# Altium project SPEC_A7.PrjPcb (part 1 of 7)
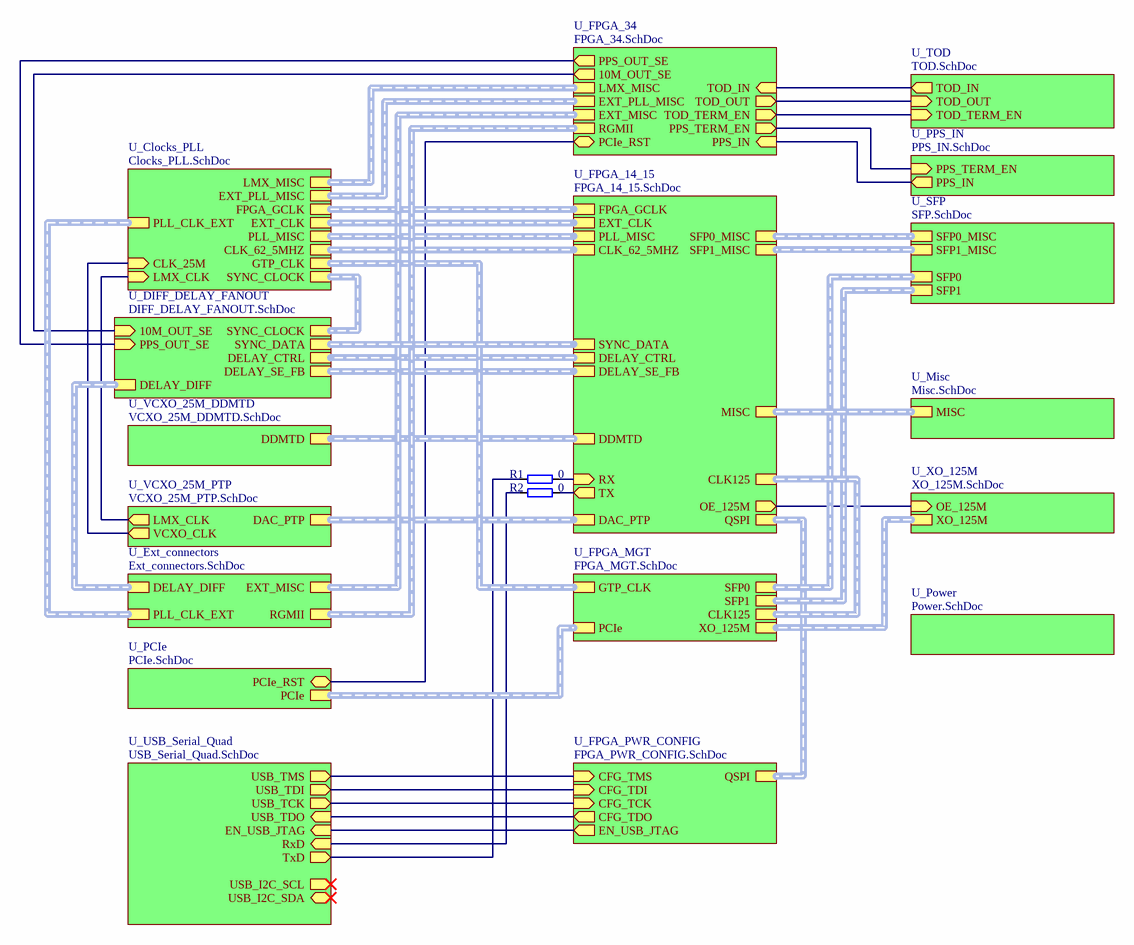
[diagram p0: SPEC-A7-TOP.SchDoc]
P_version: 1.1
18 sheets, 746 parts. Net scope: hierarchical (ports join the sheet entries above them; power ports are global).
Board file: SPEC-A7.PcbDoc
Sheets:
  SPEC-A7-TOP.SchDoc
    U_Clocks_PLL = Clocks_PLL.SchDoc
    U_FPGA_14_15 = FPGA_14_15.SchDoc
    U_DIFF_DELAY_FANOUT = DIFF_DELAY_FANOUT.SchDoc
    U_VCXO_25M_DDMTD = VCXO_25M_DDMTD.SchDoc
    U_VCXO_25M_PTP = VCXO_25M_PTP.SchDoc
    U_SFP = SFP.SchDoc
    U_FPGA_34 = FPGA_34.SchDoc
    U_USB_Serial_Quad = USB_Serial_Quad.SchDoc
    U_XO_125M = XO_125M.SchDoc
    U_FPGA_PWR_CONFIG = FPGA_PWR_CONFIG.SchDoc
    U_Ext_connectors = Ext_connectors.SchDoc
    U_FPGA_MGT = FPGA_MGT.SchDoc
    U_PCIe = PCIe.SchDoc
    U_Power = Power.SchDoc
    U_Misc = Misc.SchDoc
    U_TOD = TOD.SchDoc
    U_PPS_IN = PPS_IN.SchDoc

## Sheet SPEC-A7-TOP.SchDoc: SPEC-A7
size 420 x 297 mm; Author: G.Kasprowicz; CompanyName: WUT ISE; DrawnBy: G.Kasprowicz; Organization: WUT ISE; Address1: PW ISE; Address2: Nowowiejska 15/19 00-665 Warsaw; Address3: gkasprow@gmail.com; Revision: 2; SheetNumber: 1; SheetTotal: 18; ModifiedBy: -; CheckedDate: -; Title2: TOP; DivGrp: WUT ISE; Designer: G.Kasprowicz; ModifiedDate: -; ProjectName: Sensor Box

### Parts
R1  0  [RESC1005X40N]
R2  0  [RESC1005X40N]

### Sub-sheets
U_Clocks_PLL = Clocks_PLL.SchDoc: CLK_25M (in), PLL_MISC (harness PLL_MISC), LMX_CLK (in), LMX_MISC (harness LMX_MISC), EXT_PLL_MISC (harness PLL_MISC), CLK_62_5MHZ (harness CLK), EXT_CLK (harness CLK), PLL_CLK_EXT (harness PLL_CLK), FPGA_GCLK (harness CLK), SYNC_CLOCK (harness DFF), GTP_CLK (harness CLK)
U_DIFF_DELAY_FANOUT = DIFF_DELAY_FANOUT.SchDoc: SYNC_DATA (harness DFF), DELAY_DIFF (harness DELAY_DIFF), DELAY_CTRL (harness DELAY_CTRL), DELAY_SE_FB (harness DELAY_SE_FB), 10M_OUT_SE (in), PPS_OUT_SE (in), SYNC_CLOCK
U_Ext_connectors = Ext_connectors.SchDoc: RGMII (harness RGMII), EXT_MISC (harness EXT_CON_MISC), PLL_CLK_EXT (harness PLL_CLK), DELAY_DIFF (harness DELAY_DIFF)
U_FPGA_14_15 = FPGA_14_15.SchDoc: DDMTD (harness DDMTD), DAC_PTP (harness DAC_PTP), PLL_MISC (harness PLL_MISC), DELAY_CTRL (harness DELAY_CTRL), SYNC_DATA (harness SYNC_DATA), DELAY_SE_FB (harness DELAY_SE_FB), SFP0_MISC (harness SFP_MISC), SFP1_MISC (harness SFP_MISC), MISC (harness MISC), QSPI (harness QSPI), OE_125M (out), RX (in), TX (out), CLK_62_5MHZ (harness CLK), EXT_CLK (harness CLK), FPGA_GCLK (harness CLK), CLK125 (harness CLK)
U_FPGA_34 = FPGA_34.SchDoc: EXT_PLL_MISC (harness PLL_MISC), LMX_MISC (harness LMX_MISC), PCIe_RST (bidir), EXT_MISC (harness EXT_CON_MISC), RGMII (harness RGMII), TOD_IN (in), TOD_OUT (out), TOD_TERM_EN (out), PPS_TERM_EN (out), PPS_IN (in), PPS_OUT_SE (out), 10M_OUT_SE (out)
U_FPGA_MGT = FPGA_MGT.SchDoc: XO_125M (harness XO_125M), SFP0 (harness SFP), SFP1 (harness SFP), PCIe (harness PCIe), GTP_CLK (harness CLK), CLK125 (harness CLK)
U_FPGA_PWR_CONFIG = FPGA_PWR_CONFIG.SchDoc: CFG_TMS (in), CFG_TCK (in), CFG_TDO (out), CFG_TDI (in), EN_USB_JTAG (out), QSPI (harness QSPI)
U_Misc = Misc.SchDoc: MISC (harness MISC)
U_PCIe = PCIe.SchDoc: PCIe_RST (bidir), PCIe (harness PCIe)
U_Power = Power.SchDoc: no entries
U_PPS_IN = PPS_IN.SchDoc: PPS_TERM_EN (in), PPS_IN (out)
U_SFP = SFP.SchDoc: SFP0_MISC (harness SFP_MISC), SFP1_MISC (harness SFP_MISC), SFP0 (harness SFP), SFP1 (harness SFP)
U_TOD = TOD.SchDoc: TOD_TERM_EN (in), TOD_IN (out), TOD_OUT (in)
U_USB_Serial_Quad = USB_Serial_Quad.SchDoc: USB_TDO (in), RxD (in), USB_TMS (out), USB_TDI (out), USB_TCK (out), TxD (out), EN_USB_JTAG (in), USB_I2C_SDA (bidir), USB_I2C_SCL (out)
U_VCXO_25M_DDMTD = VCXO_25M_DDMTD.SchDoc: DDMTD (harness DDMTD)
U_VCXO_25M_PTP = VCXO_25M_PTP.SchDoc: DAC_PTP (harness DAC_PTP), VCXO_CLK (out), LMX_CLK (out)
U_XO_125M = XO_125M.SchDoc: XO_125M (harness XO_125M), OE_125M (in)

### Nets
10M_OUT_SE: sheet U_DIFF_DELAY_FANOUT/10M_OUT_SE, sheet U_FPGA_34/10M_OUT_SE
CFG_TCK: sheet U_USB_Serial_Quad/USB_TCK, sheet U_FPGA_PWR_CONFIG/CFG_TCK
CFG_TDI: sheet U_USB_Serial_Quad/USB_TDI, sheet U_FPGA_PWR_CONFIG/CFG_TDI
CFG_TDO: sheet U_USB_Serial_Quad/USB_TDO, sheet U_FPGA_PWR_CONFIG/CFG_TDO
CFG_TMS: sheet U_USB_Serial_Quad/USB_TMS, sheet U_FPGA_PWR_CONFIG/CFG_TMS
CLK_25M: sheet U_Clocks_PLL/CLK_25M, sheet U_VCXO_25M_PTP/VCXO_CLK
OE_125M: sheet U_FPGA_14_15/OE_125M, sheet U_XO_125M/OE_125M
PCIe_RST: sheet U_FPGA_34/PCIe_RST, sheet U_PCIe/PCIe_RST
PPS_IN: sheet U_FPGA_34/PPS_IN, sheet U_PPS_IN/PPS_IN
PPS_OUT_SE: sheet U_DIFF_DELAY_FANOUT/PPS_OUT_SE, sheet U_FPGA_34/PPS_OUT_SE
RX: R1.2 ; sheet U_FPGA_14_15/RX
RXD_USB: R2.1 ; sheet U_USB_Serial_Quad/RxD
TOD_IN: sheet U_FPGA_34/TOD_IN, sheet U_TOD/TOD_IN
TOD_OUT: sheet U_FPGA_34/TOD_OUT, sheet U_TOD/TOD_OUT
TX: R2.2 ; sheet U_FPGA_14_15/TX
TXD_USB: R1.1 ; sheet U_USB_Serial_Quad/TxD
NetC134_2: sheet U_USB_Serial_Quad/EN_USB_JTAG, sheet U_FPGA_PWR_CONFIG/EN_USB_JTAG
NetIC4_L2: sheet U_FPGA_34/PPS_TERM_EN, sheet U_PPS_IN/PPS_TERM_EN
NetIC4_T3: sheet U_FPGA_34/TOD_TERM_EN, sheet U_TOD/TOD_TERM_EN
NetIC16_8: sheet U_Clocks_PLL/LMX_CLK, sheet U_VCXO_25M_PTP/LMX_CLK

### Buses and harness runs
harness sheet U_Clocks_PLL/CLK_62_5MHZ = sheet U_FPGA_14_15/CLK_62_5MHZ
harness sheet U_Clocks_PLL/EXT_CLK = sheet U_FPGA_14_15/EXT_CLK
harness sheet U_Clocks_PLL/EXT_PLL_MISC = sheet U_FPGA_34/EXT_PLL_MISC
harness sheet U_Clocks_PLL/FPGA_GCLK = sheet U_FPGA_14_15/FPGA_GCLK
harness sheet U_Clocks_PLL/GTP_CLK = sheet U_FPGA_MGT/GTP_CLK
harness sheet U_Clocks_PLL/LMX_MISC = sheet U_FPGA_34/LMX_MISC
harness sheet U_Clocks_PLL/PLL_CLK_EXT = sheet U_Ext_connectors/PLL_CLK_EXT
harness sheet U_Clocks_PLL/PLL_MISC = sheet U_FPGA_14_15/PLL_MISC
harness sheet U_Clocks_PLL/SYNC_CLOCK = sheet U_DIFF_DELAY_FANOUT/SYNC_CLOCK
harness sheet U_DIFF_DELAY_FANOUT/DELAY_CTRL = sheet U_FPGA_14_15/DELAY_CTRL
harness sheet U_DIFF_DELAY_FANOUT/DELAY_DIFF = sheet U_Ext_connectors/DELAY_DIFF
harness sheet U_DIFF_DELAY_FANOUT/DELAY_SE_FB = sheet U_FPGA_14_15/DELAY_SE_FB
harness sheet U_DIFF_DELAY_FANOUT/SYNC_DATA = sheet U_FPGA_14_15/SYNC_DATA
harness sheet U_Ext_connectors/EXT_MISC = sheet U_FPGA_34/EXT_MISC
harness sheet U_Ext_connectors/RGMII = sheet U_FPGA_34/RGMII
harness sheet U_FPGA_14_15/CLK125 = sheet U_FPGA_MGT/CLK125
harness sheet U_FPGA_14_15/DAC_PTP = sheet U_VCXO_25M_PTP/DAC_PTP
harness sheet U_FPGA_14_15/DDMTD = sheet U_VCXO_25M_DDMTD/DDMTD
harness sheet U_FPGA_14_15/MISC = sheet U_Misc/MISC
harness sheet U_FPGA_14_15/QSPI = sheet U_FPGA_PWR_CONFIG/QSPI
harness sheet U_FPGA_14_15/SFP0_MISC = sheet U_SFP/SFP0_MISC
harness sheet U_FPGA_14_15/SFP1_MISC = sheet U_SFP/SFP1_MISC
harness sheet U_FPGA_MGT/PCIe = sheet U_PCIe/PCIe
harness sheet U_FPGA_MGT/SFP0 = sheet U_SFP/SFP0
harness sheet U_FPGA_MGT/SFP1 = sheet U_SFP/SFP1
harness sheet U_FPGA_MGT/XO_125M = sheet U_XO_125M/XO_125M

### Notes on the sheet
- Project/Equipment
- Document
- Designer
- Drawn by
- Check.by
- Copyright WUT ISE 2024.
  This documentation describes Open Hardware and is licensed under the CERN OHL v.2. You may redistribute and modify this documentation under the terms of the CERN OHL v.2. (http://ohwr.org/CERNOHL). This documentation is distributed WITHOUT ANY EXPRESS OR IMPLIED WARRANTY, INCLUDING OF MERCHANTABILITY, SATISFACTORY QUALITY AND FITNESS FOR A PARTICULAR PURPOSE. Please see the CERN OHL v.2 for applicable conditions.
- Contact
- File
- Last Mod.
- Print Date
- Sheet
- Size
- A3
- of
- Rev

### Library data of the parts
R1 R2 = R0402_0R_JUMPER: Resistor; Part Description: 1A (0.05R Max DC Resistance) Zero Ohm Jumper; Manufacturer: GENERIC; Manufacturer1 Part Number: 232270591001L; PressFit: No; Part Number: R0402_0R_JUMPER; Component Kind: Standard; Component Type: Standard; Pin Count: 2; Value: 0; Status: Not Recommended; Manufacturer Part Number: R0402_0R_JUMPER; Case: 0402; Mounted: Yes; Sense: No; Socket: No; SMD: Yes; Manufacturer1 Example: YAGEO PHYCOMP; Manufacturer1 ComponentHeight: 0.4mm; HelpURL: \\cern.ch\dfs\Applications\Altium\Datasheets\R0402_Phycomp_RC0402.pdf; Author: CERN DEM JLC; CreateDate: 03.12.2007; LatestRevisionDate: 17.10.2012

## Sheet Clocks_PLL.SchDoc: Title
size 420 x 297 mm; Author: G.Kasprowicz; CompanyName: WUT ISE; DrawnBy: G.Kasprowicz; Organization: WUT ISE; Address1: PW ISE; Address2: Nowowiejska 15/19 00-665 Warsaw; Address3: gkasprow@gmail.com; Revision: 2; SheetNumber: 10; SheetTotal: 18; ModifiedBy: -; CheckedDate: -; Title2: Title 2; DivGrp: WUT ISE; Designer: G.Kasprowicz; ModifiedDate: -; ProjectName: Sensor Box
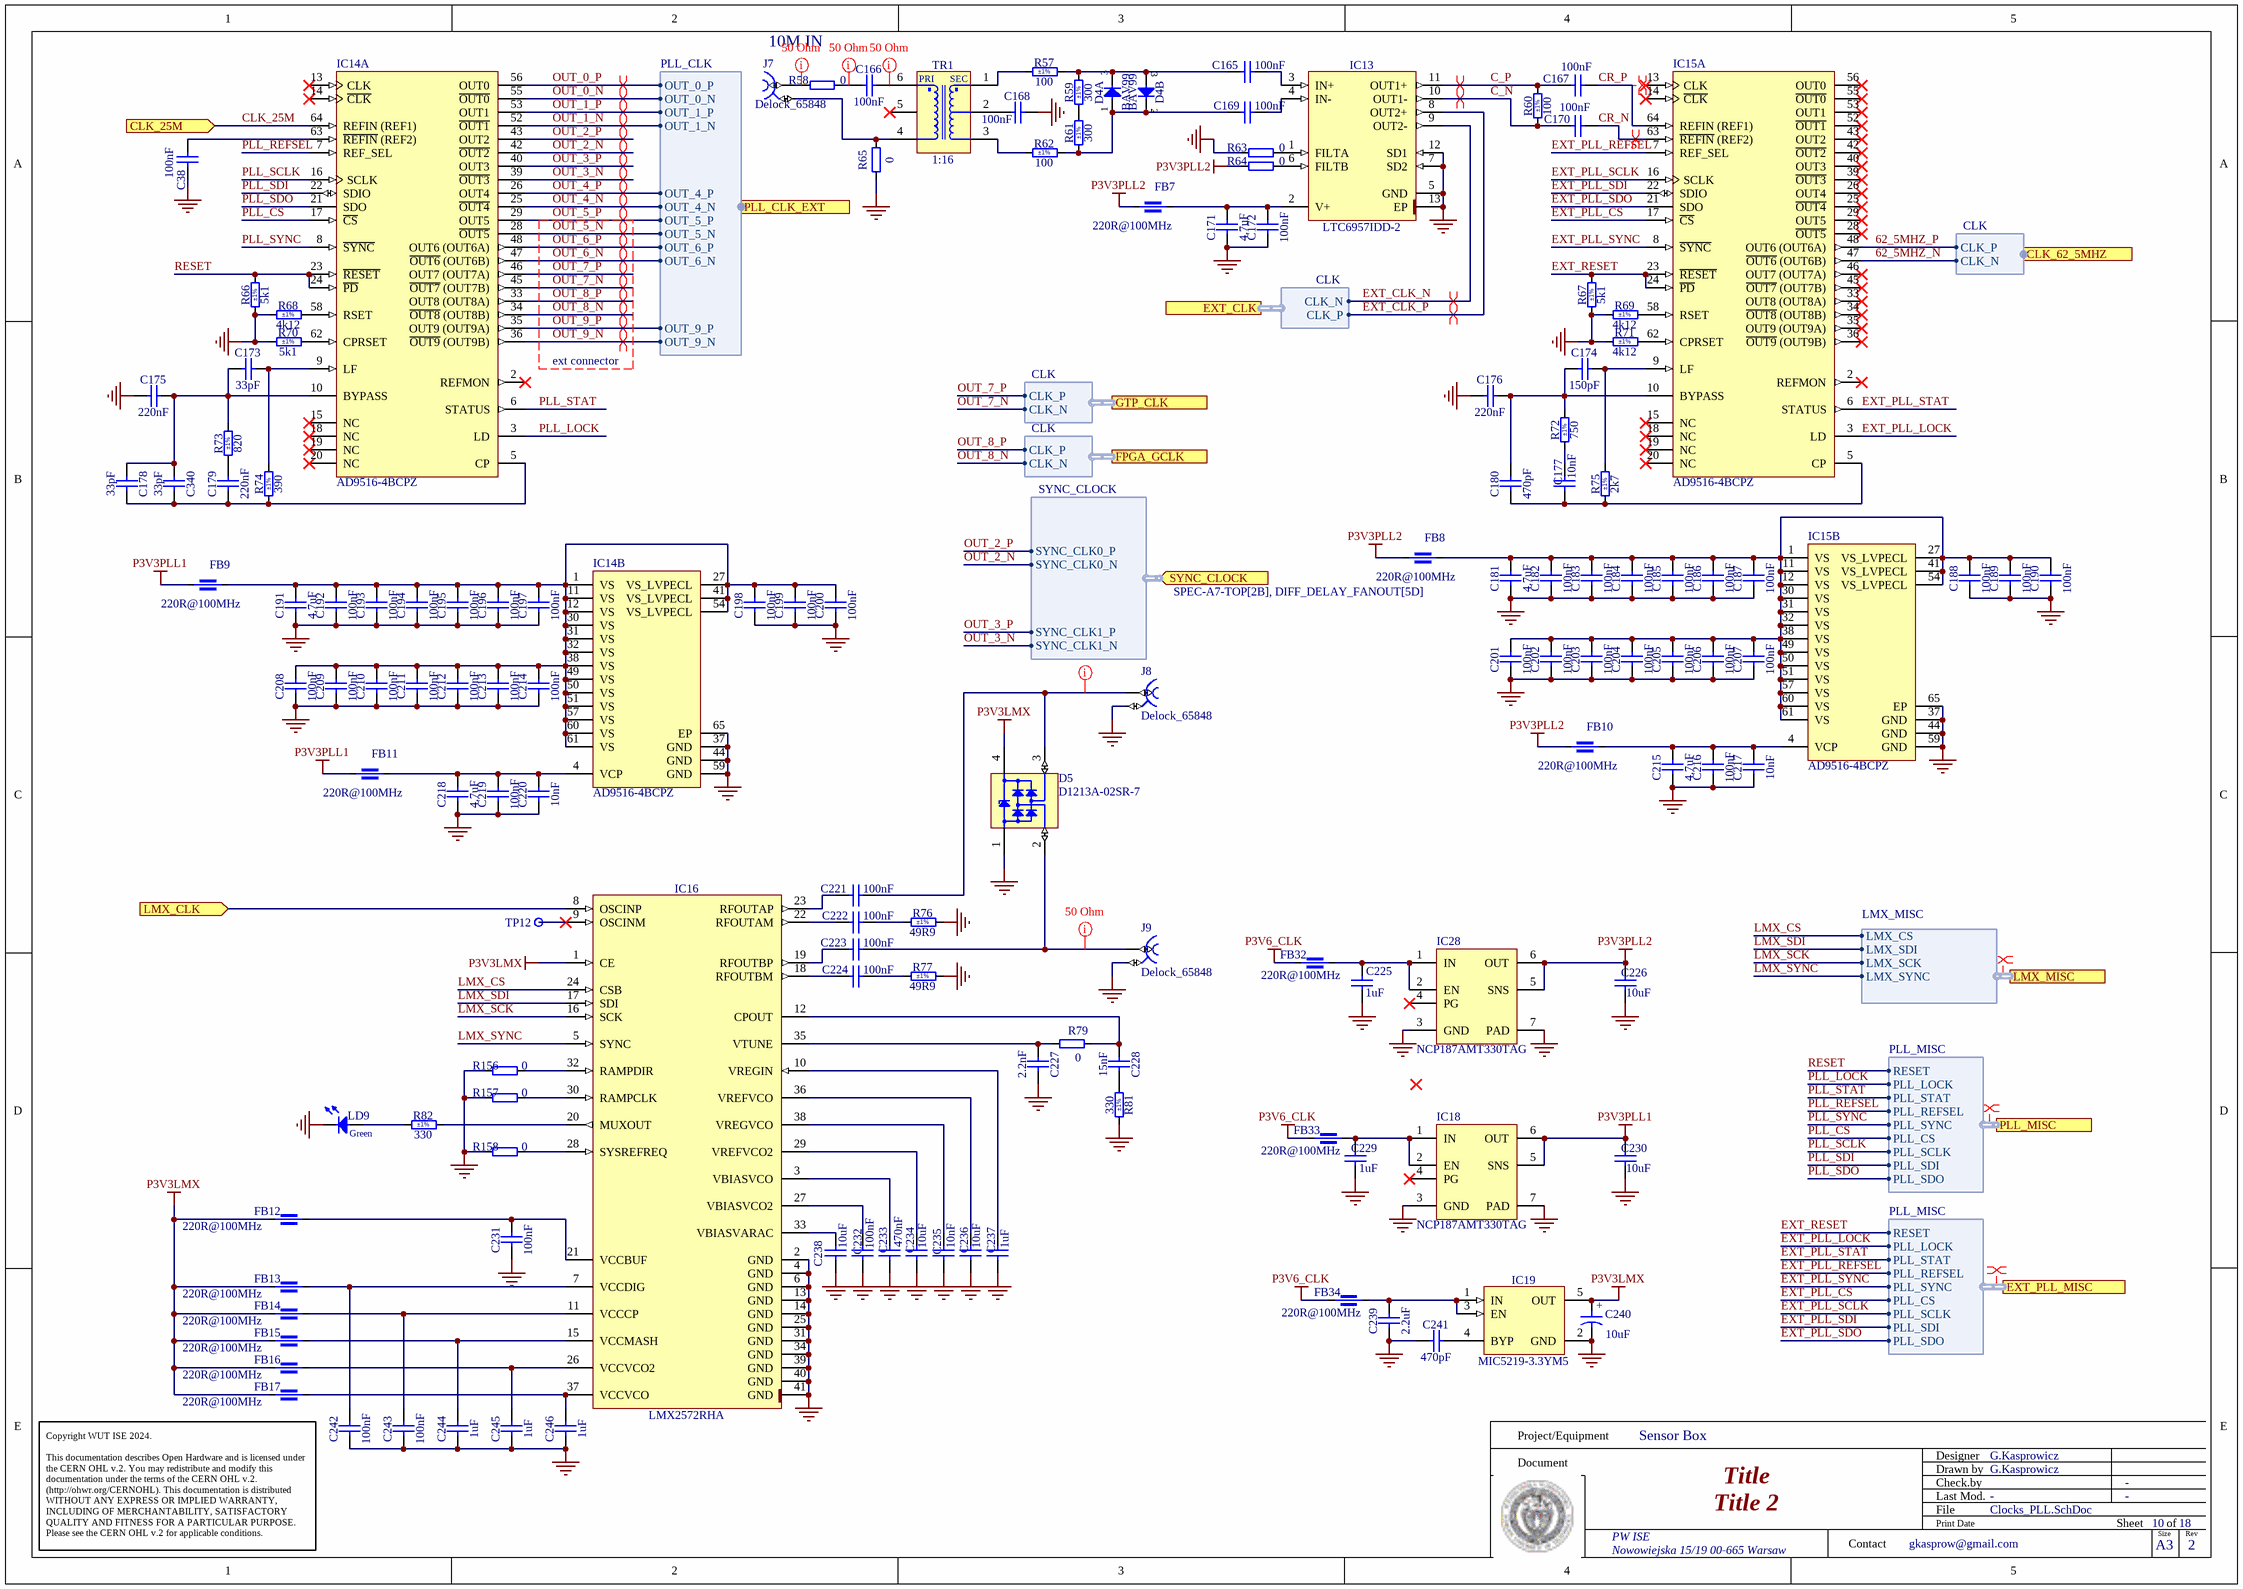
[diagram p1: Clocks_PLL.SchDoc]

### Parts
C38  100nF  [CAPC0603X33N]
C165  100nF  [CAPC0603X33N]
C166  100nF  [CAPC0603X33N]
C167  100nF  [CAPC0603X33N]
C168  100nF  [CAPC0603X33N]
C169  100nF  [CAPC0603X33N]
C170  100nF  [CAPC0603X33N]
C171  4.7uF  [CAPC1005X55N]
C172  100nF  [CAPC0603X33N]
C173  33pF  [CAPC1005X55N]
C174  150pF  [CAPC1005X55N]
C175  220nF  [CAPC1005X55N]
C176  220nF  [CAPC1005X55N]
C177  10nF  [CAPC1005X55N]
C178  33pF  [CAPC1005X55N]
C179  220nF  [CAPC1005X55N]
C180  470pF  [CAPC1005X55N]
C181  4.7uF  [CAPC1005X55N]
C182  100nF  [CAPC0603X33N]
C183  100nF  [CAPC0603X33N]
C184  100nF  [CAPC0603X33N]
C185  100nF  [CAPC0603X33N]
C186  100nF  [CAPC0603X33N]
C187  100nF  [CAPC0603X33N]
C188  100nF  [CAPC0603X33N]
C189  100nF  [CAPC0603X33N]
C190  100nF  [CAPC0603X33N]
C191  4.7uF  [CAPC1005X55N]
C192  100nF  [CAPC0603X33N]
C193  100nF  [CAPC0603X33N]
C194  100nF  [CAPC0603X33N]
C195  100nF  [CAPC0603X33N]
C196  100nF  [CAPC0603X33N]
C197  100nF  [CAPC0603X33N]
C198  100nF  [CAPC0603X33N]
C199  100nF  [CAPC0603X33N]
C200  100nF  [CAPC0603X33N]
C201  100nF  [CAPC0603X33N]
C202  100nF  [CAPC0603X33N]
C203  100nF  [CAPC0603X33N]
C204  100nF  [CAPC0603X33N]
C205  100nF  [CAPC0603X33N]
C206  100nF  [CAPC0603X33N]
C207  100nF  [CAPC0603X33N]
C208  100nF  [CAPC0603X33N]
C209  100nF  [CAPC0603X33N]
C210  100nF  [CAPC0603X33N]
C211  100nF  [CAPC0603X33N]
C212  100nF  [CAPC0603X33N]
C213  100nF  [CAPC0603X33N]
C214  100nF  [CAPC0603X33N]
C215  4.7uF  [CAPC1005X55N]
C216  100nF  [CAPC0603X33N]
C217  10nF  [CAPC1005X55N]
C218  4.7uF  [CAPC1005X55N]
C219  100nF  [CAPC0603X33N]
C220  10nF  [CAPC1005X55N]
C221  100nF  [CAPC0603X33N]
C222  100nF  [CAPC0603X33N]
C223  100nF  [CAPC0603X33N]
C224  100nF  [CAPC0603X33N]
C225  1uF  [CAPC1005X55N]
C226  10uF  [CAPC1608X80N]
C227  2.2nF  [CAPC1005X55N]
C228  15nF  [CAPC1005X55N]
C229  1uF  [CAPC1005X55N]
C230  10uF  [CAPC1608X80N]
C231  100nF  [CAPC0603X33N]
C232  100nF  [CAPC0603X33N]
C233  470nF  [CAPC0603X33N]
C234  10uF  [CAPC1608X80N]
C235  10nF  [CAPC1005X55N]
C236  10uF  [CAPC1608X80N]
C237  1uF  [CAPC1005X55N]
C238  10uF  [CAPC1608X80N]
C239  2.2uF  [CAPC1608X90N]
C240  10uF  [CAPMP3216X180N]
C241  470pF  [CAPC1005X55N]
C242  100nF  [CAPC0603X33N]
C243  100nF  [CAPC0603X33N]
C244  1uF  [CAPC1005X55N]
C245  1uF  [CAPC1005X55N]
C246  1uF  [CAPC1005X55N]
C340  33pF  [CAPC1005X55N]
D4  BAV99  [SOT95P240X110-3N]  (parts A,B of 2)
D5  D1213A-02SR-7  [SOT190P238X100-4N]
FB7  220R@100MHz  [INDC1608X95N]
FB8  220R@100MHz  [INDC1608X95N]
FB9  220R@100MHz  [INDC1608X95N]
FB10  220R@100MHz  [INDC1608X95N]
FB11  220R@100MHz  [INDC1608X95N]
FB12  220R@100MHz  [INDC1608X95N]
FB13  220R@100MHz  [INDC1608X95N]
FB14  220R@100MHz  [INDC1608X95N]
FB15  220R@100MHz  [INDC1608X95N]
FB16  220R@100MHz  [INDC1608X95N]
FB17  220R@100MHz  [INDC1608X95N]
FB32  220R@100MHz  [INDC1608X95N]
FB33  220R@100MHz  [INDC1608X95N]
FB34  220R@100MHz  [INDC1608X95N]
IC13  LTC6957IDD-2  [SON45P300X300X80-13N-R175X248]
IC14  AD9516-4BCPZ  [ADI-CP-64-4_N]  (parts A,B of 2)
IC15  AD9516-4BCPZ  [ADI-CP-64-4_N]  (parts A,B of 2)
IC16  LMX2572RHA  [QFN50P600X600X100-41N-S460]
IC18  NCP187AMT330TAG  [SON65P200X200X80-7N-R110X170]
IC19  MIC5219-3.3YM5  [SOT95P280X145-5N]
IC28  NCP187AMT330TAG  [SON65P200X200X80-7N-R110X170]
J7  Delock_65848  [Delock_65848]
J8  Delock_65848  [Delock_65848]
J9  Delock_65848  [Delock_65848]
LD9  Green  [LED_KINGBRIGHT_KPH-1608CGCK]
R57  100  Tolerance: ±1%  [RESC1005X40N]
R58  0  [RESC1005X40N]
R59  300  Tolerance: ±1%  [RESC1005X40N]
R60  100  Tolerance: ±1%  [RESC1005X40N]
R61  300  Tolerance: ±1%  [RESC1005X40N]
R62  100  Tolerance: ±1%  [RESC1005X40N]
R63  0  [RESC1005X40N]
R64  0  [RESC1005X40N]
R65  0  [RESC1005X40N]
R66  5k1  Tolerance: ±1%  [RESC1005X40N]
R67  5k1  Tolerance: ±1%  [RESC1005X40N]
R68  4k12  Tolerance: ±1%  [RESC1005X40N]
R69  4k12  Tolerance: ±1%  [RESC1005X40N]
R70  5k1  Tolerance: ±1%  [RESC1005X40N]
R71  4k12  Tolerance: ±1%  [RESC1005X40N]
R72  750  Tolerance: ±1%  [RESC1005X40N]
R73  820  Tolerance: ±1%  [RESC1005X40N]
R74  390  Tolerance: ±1%  [RESC1005X40N]
R75  2k7  Tolerance: ±1%  [RESC1608X55N]
R76  49R9  Tolerance: ±1%  [RESC1005X40N]
R77  49R9  Tolerance: ±1%  [RESC1005X40N]
R79  0  [RESC1005X40N]
R81  330  Tolerance: ±1%  [RESC1005X40N]
R82  330  Tolerance: ±1%  [RESC1005X40N]
R156  0  [RESC1005X40N]
R157  0  [RESC1005X40N]
R158  0  [RESC1005X40N]
TP12  Test Point  [TPS127]  (value not drawn)  (no BOM)
TR1  1:16  [XFMR_COILCRAFT_WBC]

### Ports
CLK_25M (in, see SPEC-A7-TOP[2B]), CLK_62_5MHZ (harness CLK, see SPEC-A7-TOP[2B], FPGA_14_15[3D]), EXT_CLK (harness CLK, see SPEC-A7-TOP[2B], FPGA_14_15[5D]), EXT_PLL_MISC (harness PLL_MISC, see SPEC-A7-TOP[2B], FPGA_34[4C]), FPGA_GCLK (harness CLK, see SPEC-A7-TOP[2B], FPGA_14_15[5D]), GTP_CLK (harness CLK, see SPEC-A7-TOP[2B], FPGA_MGT[1E]), LMX_CLK (in, see SPEC-A7-TOP[2B], VCXO_25M_PTP[4C]), LMX_MISC (harness LMX_MISC, see SPEC-A7-TOP[2B], FPGA_34[4C]), PLL_CLK_EXT (harness PLL_CLK, see SPEC-A7-TOP[2B], Ext_connectors[3D]), PLL_MISC (harness PLL_MISC, see SPEC-A7-TOP[2B], FPGA_14_15[1D]), SYNC_CLOCK (in, harness SYNC_CLOCK, see SPEC-A7-TOP[2B], DIFF_DELAY_FANOUT[5D])

### Harnesses
PLL_MISC: RESET, PLL_LOCK, PLL_STAT, PLL_REFSEL, PLL_SYNC, PLL_CS, PLL_SCLK, PLL_SDI, PLL_SDO
PLL_CLK: OUT_0_P, OUT_0_N, OUT_1_P, OUT_1_N, OUT_4_P, OUT_4_N, OUT_5_P, OUT_5_N, OUT_6_P, OUT_6_N, OUT_9_P, OUT_9_N
LMX_MISC: LMX_CS, LMX_SDI, LMX_SCK, LMX_SYNC
CLK: CLK_P, CLK_N
SYNC_CLOCK: SYNC_CLK0_P, SYNC_CLK0_N, SYNC_CLK1_P, SYNC_CLK1_N

### Nets
GND: C38.1 C168.2 C171.1 C172.1 C175.1 C176.1 C181.1 C182.1 C183.1 C184.1 C185.1 C186.1 C187.1 C188.1 C189.1 C190.1 C191.1 C192.1 C193.1 C194.1 C195.1 C196.1 C197.1 C198.1 C199.1 C200.1 C201.1 C202.1 C203.1 C204.1 C205.1 C206.1 C207.1 C208.1 C209.1 C210.1 C211.1 C212.1 C213.1 C214.1 C215.1 C216.1 C217.1 C218.1 C219.1 C220.1 C225.1 C226.1 C227.1 C229.1 C230.1 C231.1 C232.1 C233.1 C234.1 C235.1 C236.1 C237.1 C238.1 C239.1 C240.2 C241.1 C242.1 C243.1 C244.1 C245.1 C246.1 D5.1(GND) IC13.5(GND) IC13.7(SD2) IC13.12(SD1) IC13.13(EP) IC14.37(GND) IC14.44(GND) IC14.59(GND) IC14.65(EP) IC15.37(GND) IC15.44(GND) IC15.59(GND) IC15.65(EP) IC16.2(GND) IC16.4(GND) IC16.6(GND) IC16.13(GND) IC16.14(GND) IC16.25(GND) IC16.31(GND) IC16.34(GND) IC16.39(GND) IC16.40(GND) IC16.41(GND) IC18.3(GND) IC18.7(PAD) IC19.2(GND) IC28.3(GND) IC28.7(PAD) J8.2 J9.2 LD9.1(C) R63.1 R65.1 R66.1 R67.1 R68.1 R69.1 R70.1 R71.1 R76.2 R77.2 R81.1 R156.2 R157.2 R158.2
P3V3LMX: C240.1 D5.4(VCC) FB12.1 FB13.1 FB14.1 FB15.1 FB16.1 FB17.1 IC16.1(CE) IC19.5(OUT)
P3V3PLL1: C230.2 FB9.1 FB11.1 IC18.5(SNS) IC18.6(OUT)
P3V3PLL2: C226.2 FB7.1 FB8.1 FB10.1 IC28.5(SNS) IC28.6(OUT) R64.1
P3V6_CLK: FB32.1 FB33.1 FB34.1
62_5MHZ_N: IC15.47(~{OUT6}_(OUT6B)) ; port CLK_62_5MHZ.CLK_N
62_5MHZ_P: IC15.48(OUT6_(OUT6A)) ; port CLK_62_5MHZ.CLK_P
C_N: C170.1 IC13.10(OUT1-) R60.1
C_P: C167.1 IC13.11(OUT1+) R60.2
CLK_25M: IC14.64(REFIN_(REF1)) ; port CLK_25M
CR_N: C170.2 IC15.63(~{REFIN}_(REF2))
CR_P: C167.2 IC15.64(REFIN_(REF1))
EXT_CLK_N: IC13.9(OUT2-) ; port EXT_CLK.CLK_N
EXT_CLK_P: IC13.8(OUT2+) ; port EXT_CLK.CLK_P
EXT_PLL_CS: IC15.17(~{CS}) ; port EXT_PLL_MISC.PLL_CS
EXT_PLL_LOCK: IC15.3(LD) ; port EXT_PLL_MISC.PLL_LOCK
EXT_PLL_REFSEL: IC15.7(REF_SEL) ; port EXT_PLL_MISC.PLL_REFSEL
EXT_PLL_SCLK: IC15.16(SCLK) ; port EXT_PLL_MISC.PLL_SCLK
EXT_PLL_SDI: IC15.22(SDIO) ; port EXT_PLL_MISC.PLL_SDI
EXT_PLL_SDO: IC15.21(SDO) ; port EXT_PLL_MISC.PLL_SDO
EXT_PLL_STAT: IC15.6(STATUS) ; port EXT_PLL_MISC.PLL_STAT
EXT_PLL_SYNC: IC15.8(~{SYNC}) ; port EXT_PLL_MISC.PLL_SYNC
EXT_RESET: IC15.23(~{RESET}) IC15.24(~{PD}) R67.2 ; port EXT_PLL_MISC.RESET
LMX_CS: IC16.24(CSB) ; port LMX_MISC.LMX_CS
LMX_SCK: IC16.16(SCK) ; port LMX_MISC.LMX_SCK
LMX_SDI: IC16.17(SDI) ; port LMX_MISC.LMX_SDI
LMX_SYNC: IC16.5(SYNC) ; port LMX_MISC.LMX_SYNC
OUT_0_N: IC14.55(~{OUT0}) ; port PLL_CLK_EXT.OUT_0_N  [project net EXT_CLK_0_N]
OUT_0_P: IC14.56(OUT0) ; port PLL_CLK_EXT.OUT_0_P  [project net EXT_CLK_0_P]
OUT_1_N: IC14.52(~{OUT1}) ; port PLL_CLK_EXT.OUT_1_N  [project net EXT_CLK_1_N]
OUT_1_P: IC14.53(OUT1) ; port PLL_CLK_EXT.OUT_1_P  [project net EXT_CLK_1_P]
OUT_2_N: IC14.42(~{OUT2}) ; port SYNC_CLOCK.SYNC_CLK0_N
OUT_2_P: IC14.43(OUT2) ; port SYNC_CLOCK.SYNC_CLK0_P
OUT_3_N: IC14.39(~{OUT3}) ; port SYNC_CLOCK.SYNC_CLK1_N
OUT_3_P: IC14.40(OUT3) ; port SYNC_CLOCK.SYNC_CLK1_P
OUT_4_N: IC14.25(~{OUT4}) ; port PLL_CLK_EXT.OUT_4_N  [project net EXT_CLK_4_N]
OUT_4_P: IC14.26(OUT4) ; port PLL_CLK_EXT.OUT_4_P  [project net EXT_CLK_4_P]
OUT_5_N: IC14.28(~{OUT5}) ; port PLL_CLK_EXT.OUT_5_N  [project net EXT_CLK_5_N]
OUT_5_P: IC14.29(OUT5) ; port PLL_CLK_EXT.OUT_5_P  [project net EXT_CLK_5_P]
OUT_6_N: IC14.47(~{OUT6}_(OUT6B)) ; port PLL_CLK_EXT.OUT_6_N  [project net EXT_CLK_6_N]
OUT_6_P: IC14.48(OUT6_(OUT6A)) ; port PLL_CLK_EXT.OUT_6_P  [project net EXT_CLK_6_P]
OUT_7_N: IC14.45(~{OUT7}_(OUT7B)) ; port GTP_CLK.CLK_N  [project net GTP_CLK_REF_N]
OUT_7_P: IC14.46(OUT7_(OUT7A)) ; port GTP_CLK.CLK_P  [project net GTP_CLK_REF_P]
OUT_8_N: IC14.34(~{OUT8}_(OUT8B)) ; port FPGA_GCLK.CLK_N  [project net FPGA_GCLK_N]
OUT_8_P: IC14.33(OUT8_(OUT8A)) ; port FPGA_GCLK.CLK_P  [project net FPGA_GCLK_P]
OUT_9_N: IC14.36(~{OUT9}_(OUT9B)) ; port PLL_CLK_EXT.OUT_9_N  [project net EXT_CLK_9_N]
OUT_9_P: IC14.35(OUT9_(OUT9A)) ; port PLL_CLK_EXT.OUT_9_P  [project net EXT_CLK_9_P]
PLL_CS: IC14.17(~{CS}) ; port PLL_MISC.PLL_CS
PLL_LOCK: IC14.3(LD) ; port PLL_MISC.PLL_LOCK
PLL_REFSEL: IC14.7(REF_SEL) ; port PLL_MISC.PLL_REFSEL
PLL_SCLK: IC14.16(SCLK) ; port PLL_MISC.PLL_SCLK
PLL_SDI: IC14.22(SDIO) ; port PLL_MISC.PLL_SDI
PLL_SDO: IC14.21(SDO) ; port PLL_MISC.PLL_SDO
PLL_STAT: IC14.6(STATUS) ; port PLL_MISC.PLL_STAT
PLL_SYNC: IC14.8(~{SYNC}) ; port PLL_MISC.PLL_SYNC
RESET: IC14.23(~{RESET}) IC14.24(~{PD}) R66.2 ; port PLL_MISC.RESET  [project net PLL_RESET]
NetC38_2: C38.2 IC14.63(~{REFIN}_(REF2))
NetC165_1: C165.1 D4.3(COMAC) R57.2 R59.2
NetC165_2: C165.2 IC13.3(IN+)
NetC166_1: C166.1 R58.2
NetC166_2: C166.2 TR1.6(SDOT1)
NetC168_1: C168.1 TR1.2(PDOT2)
NetC169_1: C169.1 D4.1(A) D4.2(C) R61.1 R62.2
NetC169_2: C169.2 IC13.4(IN-)
NetC171_2: C171.2 C172.2 FB7.2 IC13.2(V+)
NetC173_1: C173.1 C175.2 C178.1 C340.1 IC14.10(BYPASS) R73.2
NetC173_2: C173.2 IC14.9(LF) R74.2
NetC174_1: C174.1 C176.2 C180.2 IC15.10(BYPASS) R72.2
NetC174_2: C174.2 IC15.9(LF) R75.2
NetC177_1: C177.1 C180.1 IC15.5(CP) R75.1
NetC177_2: C177.2 R72.1
NetC178_2: C178.2 C179.1 C340.2 IC14.5(CP) R74.1
NetC179_2: C179.2 R73.1
NetC181_2: C181.2 C182.2 C183.2 C184.2 C185.2 C186.2 C187.2 C188.2 C189.2 C190.2 C201.2 C202.2 C203.2 C204.2 C205.2 C206.2 C207.2 FB8.2 IC15.1(VS) IC15.11(VS) IC15.12(VS) IC15.27(VS_LVPECL) IC15.30(VS) IC15.31(VS) IC15.32(VS) IC15.38(VS) IC15.41(VS_LVPECL) IC15.49(VS) IC15.50(VS) IC15.51(VS) IC15.54(VS_LVPECL) IC15.57(VS) IC15.60(VS) IC15.61(VS)
NetC191_2: C191.2 C192.2 C193.2 C194.2 C195.2 C196.2 C197.2 C198.2 C199.2 C200.2 C208.2 C209.2 C210.2 C211.2 C212.2 C213.2 C214.2 FB9.2 IC14.1(VS) IC14.11(VS) IC14.12(VS) IC14.27(VS_LVPECL) IC14.30(VS) IC14.31(VS) IC14.32(VS) IC14.38(VS) IC14.41(VS_LVPECL) IC14.49(VS) IC14.50(VS) IC14.51(VS) IC14.54(VS_LVPECL) IC14.57(VS) IC14.60(VS) IC14.61(VS)
NetC215_2: C215.2 C216.2 C217.2 FB10.2 IC15.4(VCP)
NetC218_2: C218.2 C219.2 C220.2 FB11.2 IC14.4(VCP)
NetC221_1: C221.1 IC16.23(RFOUTAP)
NetC221_2: C221.2 D5.3(I/O2) J8.1
NetC222_1: C222.1 IC16.22(RFOUTAM)
NetC222_2: C222.2 R76.1
NetC223_1: C223.1 IC16.19(RFOUTBP)
NetC223_2: C223.2 D5.2(I/O1) J9.1
NetC224_1: C224.1 IC16.18(RFOUTBM)
NetC224_2: C224.2 R77.1
NetC225_2: C225.2 FB32.2 IC28.1(IN) IC28.2(EN)
NetC227_2: C227.2 IC16.35(VTUNE) R79.2
NetC228_1: C228.1 R81.2
NetC228_2: C228.2 IC16.12(CPOUT) R79.1
NetC229_2: C229.2 FB33.2 IC18.1(IN) IC18.2(EN)
NetC231_2: C231.2 FB12.2 IC16.21(VCCBUF)
NetC232_2: C232.2 IC16.27(VBIASVCO2)
NetC233_2: C233.2 IC16.3(VBIASVCO)
NetC234_2: C234.2 IC16.29(VREFVCO2)
NetC235_2: C235.2 IC16.38(VREGVCO)
NetC236_2: C236.2 IC16.36(VREFVCO)
NetC237_2: C237.2 IC16.10(VREGIN)
NetC238_2: C238.2 IC16.33(VBIASVARAC)
NetC239_2: C239.2 FB34.2 IC19.1(IN) IC19.3(EN)
NetC241_2: C241.2 IC19.4(BYP)
NetC242_2: C242.2 FB13.2 IC16.7(VCCDIG)
NetC243_2: C243.2 FB14.2 IC16.11(VCCCP)
NetC244_2: C244.2 FB15.2 IC16.15(VCCMASH)
NetC245_2: C245.2 FB16.2 IC16.26(VCCVCO2)
NetC246_2: C246.2 FB17.2 IC16.37(VCCVCO)
NetIC13_1: IC13.1(FILTA) R63.2
NetIC13_6: IC13.6(FILTB) R64.2
NetIC14_58: IC14.58(RSET) R68.2
NetIC14_62: IC14.62(CPRSET) R70.2
NetIC15_58: IC15.58(RSET) R69.2
NetIC15_62: IC15.62(CPRSET) R71.2
NetIC16_8: IC16.8(OSCINP) ; port LMX_CLK
NetIC16_9: IC16.9(OSCINM) TP12.1
NetIC16_20: IC16.20(MUXOUT) R82.2
NetIC16_28: IC16.28(SYSREFREQ) R158.1
NetIC16_30: IC16.30(RAMPCLK) R157.1
NetIC16_32: IC16.32(RAMPDIR) R156.1
NetJ7_1: J7.1 R58.1
NetJ7_2: J7.2 R65.2 TR1.4(S)
NetLD9_2: LD9.2(A) R82.1
NetR57_1: R57.1 TR1.1(PDOT1)
NetR59_1: R59.1 R61.2
NetR62_1: R62.1 TR1.3(P)

Not connected (* = marked no-connect by the designer): IC14 2(REFMON)* 13(CLK)* 14(~{CLK})* 15(NC)* 18(NC)* 19(NC)* 20(NC)*; IC15 2(REFMON)* 13(CLK)* 14(~{CLK})* 15(NC)* 18(NC)* 19(NC)* 20(NC)* 25(~{OUT4})* 26(OUT4)* 28(~{OUT5})* 29(OUT5)* 33(OUT8_(OUT8A))* 34(~{OUT8}_(OUT8B))* 35(OUT9_(OUT9A))* 36(~{OUT9}_(OUT9B))* 39(~{OUT3})* 40(OUT3)* 42(~{OUT2})* 43(OUT2)* 45(~{OUT7}_(OUT7B))* 46(OUT7_(OUT7A))* 52(~{OUT1})* 53(OUT1)* 55(~{OUT0})* 56(OUT0)*; IC18 4(PG)*; IC28 4(PG)*; TR1 5(SDOT2)*

### Layout directives
differential pair: C_N, C_P, CR_N, CR_P, EXT_CLK_0_N, EXT_CLK_0_P, EXT_CLK_1_N, EXT_CLK_1_P, EXT_CLK_4_N, EXT_CLK_4_P, EXT_CLK_5_N, EXT_CLK_5_P, EXT_CLK_6_N, EXT_CLK_6_P, EXT_CLK_9_N, EXT_CLK_9_P, EXT_CLK_N, EXT_CLK_P, FPGA_GCLK_N, FPGA_GCLK_P, GTP_CLK_REF_N, GTP_CLK_REF_P, OUT_2_N, OUT_2_P, OUT_3_N, OUT_3_P
net class EPLL: (no net found under the mark)
net class PLL: (no net found under the mark)
net class LMX: (no net found under the mark)
net class 50_Ohm: NetC166_1, NetC166_2, NetC221_2, NetC223_2, NetJ7_1

### Notes on the sheet
- 10M IN
- ext connector
- Project/Equipment
- Document
- Designer
- Drawn by
- Check.by
- Copyright WUT ISE 2024.
  This documentation describes Open Hardware and is licensed under the CERN OHL v.2. You may redistribute and modify this documentation under the terms of the CERN OHL v.2. (http://ohwr.org/CERNOHL). This documentation is distributed WITHOUT ANY EXPRESS OR IMPLIED WARRANTY, INCLUDING OF MERCHANTABILITY, SATISFACTORY QUALITY AND FITNESS FOR A PARTICULAR PURPOSE. Please see the CERN OHL v.2 for applicable conditions.
- Contact
- File
- Last Mod.
- Print Date
- Sheet
- Size
- A3
- of
- Rev
- (in symbol CTE3216-18_10UF_10V_10%_LESR1800) +
- (in symbol XFMR_COILCRAFT_WBC16-1TLB) PRI; SEC

### Library data of the parts
C38 C165-C170 C172 C182-C190 C192-C214 C216 C219 C221-C224 C231 C232 C242 C243 = CC0201_100NF_6.3V_10%_X5R: Non-polarised capacitor; Part Description: SMD Multilayer Chip Ceramic Capacitor; Manufacturer: GENERIC; Manufacturer1 Part Number: 02016D104KAT2A; Voltage: 6.3V; TC: X5R; Tolerance: ±10%; Part Number: CC0201_100NF_6.3V_10%_X5R; Component Kind: Standard; Component Type: Standard; Pin Count: 2; Value: 100nF; Status: Not Recommended; Manufacturer Part Number: CC0201_100NF_6.3V_10%_X5R; Case: 0201; Mounted: Yes; Socket: No; SMD: Yes; Sense: No; Manufacturer1 Example: AVX; Manufacturer1 ComponentHeight: 0.33mm; HelpURL: \\cern.ch\dfs\Applications\Altium\Datasheets\CC0201_X5R_AVX.pdf; Author: CERN DEM JLC; CreateDate: 03.12.2007; LatestRevisionDate: 03.12.2007
C171 C181 C191 C215 C218 = CC0402_4.7UF_6.3V_20%_X5R: Non-polarised capacitor; Part Description: SMD Multilayer Chip Ceramic Capacitor; Manufacturer: GENERIC; Manufacturer1 Part Number: C1005X5R0J475M050BC; Voltage: 6.3V; TC: X5R; Tolerance: ±20%; Part Number: CC0402_4.7UF_6.3V_20%_X5R; Component Kind: Standard; Component Type: Standard; Pin Count: 2; Value: 4.7uF; Status: Preferred; Manufacturer Part Number: CC0402_4.7UF_6.3V_20%_X5R; Case: 0402; Mounted: Yes; Socket: No; SMD: Yes; Sense: No; Manufacturer1 Example: TDK; Manufacturer1 ComponentHeight: 0.65mm; HelpURL: \\cern.ch\dfs\Applications\Altium\Datasheets\CC0402_X5R_TDK_C.pdf; Author: CERN DEM JLC; CreateDate: 03.03.2015; LatestRevisionDate: 03.03.2015
C173 C178 C340 = CC0402_33PF_50V_5%_C0G: Non-polarised capacitor; Part Description: SMD Multilayer Chip Ceramic Capacitor; Manufacturer: GENERIC; Manufacturer1 Part Number: C0402C330J5GACTU; Voltage: 50V; TC: C0G/NP0; Tolerance: ±5%; Part Number: CC0402_33PF_50V_5%_C0G; Component Kind: Standard; Component Type: Standard; Pin Count: 2; Value: 33pF; Status: Preferred; Manufacturer Part Number: CC0402_33PF_50V_5%_C0G; Case: 0402; Mounted: Yes; Socket: No; SMD: Yes; Sense: No; Manufacturer1 Example: KEMET; Manufacturer1 ComponentHeight: 0.55mm; HelpURL: \\cern.ch\dfs\Applications\Altium\Datasheets\CC0402_C0G_KEMET_(Commercial Grade).pdf; Author: CERN DEM JLC; CreateDate: 03.12.2007; LatestRevisionDate: 22.04.2015
C174 = CC0402_150PF_50V_5%_C0G: Non-polarised capacitor; Part Description: SMD Multilayer Chip Ceramic Capacitor; Manufacturer: GENERIC; Manufacturer1 Part Number: C0402C151J5GACTU; Voltage: 50V; TC: C0G/NP0; Tolerance: ±5%; Part Number: CC0402_150PF_50V_5%_C0G; Component Kind: Standard; Component Type: Standard; Pin Count: 2; Value: 150pF; Status: Preferred; Manufacturer Part Number: CC0402_150PF_50V_5%_C0G; Case: 0402; Mounted: Yes; Socket: No; SMD: Yes; Sense: No; Manufacturer1 Example: KEMET; Manufacturer1 ComponentHeight: 0.55mm; HelpURL: \\cern.ch\dfs\Applications\Altium\Datasheets\CC0402_C0G_KEMET_(Commercial Grade).pdf; Author: CERN DEM JLC; CreateDate: 03.12.2007; LatestRevisionDate: 22.04.2015
C175 C176 C179 = CC0402_220NF_16V_10%_X7R: Non-polarised capacitor; Part Description: SMD Multilayer Chip Ceramic Capacitor; Manufacturer: GENERIC; Manufacturer1 Part Number: C1005X7R1C224K050; Voltage: 16V; TC: X7R; Tolerance: ±10%; Part Number: CC0402_220NF_16V_10%_X7R; Component Kind: Standard; Component Type: Standard; Pin Count: 2; Value: 220nF; Status: Preferred; Manufacturer Part Number: CC0402_220NF_16V_10%_X7R; Case: 0402; Mounted: Yes; Socket: No; SMD: Yes; Sense: No; Manufacturer1 Example: TDK; Manufacturer1 ComponentHeight: 0.55mm; HelpURL: \\cern.ch\dfs\Applications\Altium\Datasheets\CC0402_X7R_TDK_C.pdf; Author: CERN DEM JLC; CreateDate: 25.10.2012; LatestRevisionDate: 25.10.2012
C177 C217 C220 C235 = CC0402_10NF_16V_10%_X7R: Non-polarised capacitor; Part Description: SMD Multilayer Chip Ceramic Capacitor; Manufacturer: GENERIC; Manufacturer1 Part Number: 223878715636; Voltage: 16V; TC: X7R; Tolerance: ±10%; Part Number: CC0402_10NF_16V_10%_X7R; Component Kind: Standard; Component Type: Standard; Pin Count: 2; Value: 10nF; Status: Not Recommended; Manufacturer Part Number: CC0402_10NF_16V_10%_X7R; Case: 0402; Mounted: Yes; Socket: No; SMD: Yes; Sense: No; Manufacturer1 Example: PHYCOMP; Manufacturer1 ComponentHeight: 0.55mm; HelpURL: \\cern.ch\dfs\Applications\Altium\Datasheets\CC0402_X7R_PHYCOMP.pdf; Author: CERN DEM JLC; CreateDate: 03.12.2007; LatestRevisionDate: 03.12.2007
C180 C241 = CC0402_470PF_50V_10%_X7R: Non-polarised capacitor; Part Description: SMD Multilayer Chip Ceramic Capacitor; Manufacturer: GENERIC; Manufacturer1 Part Number: 223858715618; Voltage: 50V; TC: X7R; Tolerance: ±10%; Part Number: CC0402_470PF_50V_10%_X7R; Component Kind: Standard; Component Type: Standard; Pin Count: 2; Value: 470pF; Status: Not Recommended; Manufacturer Part Number: CC0402_470PF_50V_10%_X7R; Case: 0402; Mounted: Yes; Socket: No; SMD: Yes; Sense: No; Manufacturer1 Example: PHYCOMP; Manufacturer1 ComponentHeight: 0.55mm; HelpURL: \\cern.ch\dfs\Applications\Altium\Datasheets\CC0402_NP0_PHYCOMP.pdf; Author: CERN DEM JLC; CreateDate: 03.12.2007; LatestRevisionDate: 03.12.2007
C225 C229 C237 C244-C246 = CC0402_1UF_16V_10%_X5R: Non-polarised capacitor; Part Description: SMD Multilayer Chip Ceramic Capacitor; Manufacturer: GENERIC; Manufacturer1 Part Number: C1005X5R1C105KT; Voltage: 16V; TC: X5R; Tolerance: ±10%; Part Number: CC0402_1UF_16V_10%_X5R; Component Kind: Standard; Component Type: Standard; Pin Count: 2; Value: 1uF; Status: Preferred; Manufacturer Part Number: CC0402_1UF_16V_10%_X5R; Case: 0402; Mounted: Yes; Socket: No; SMD: Yes; Sense: No; Manufacturer1 Example: TDK; Manufacturer1 ComponentHeight: 0.55mm; HelpURL: \\cern.ch\dfs\Applications\Altium\Datasheets\CC0402_X5R_TDK_C.pdf; Author: CERN DEM JLC; CreateDate: 25.10.2012; LatestRevisionDate: 25.10.2012
C226 C230 C234 C236 C238 = CC0603_10UF_16V_20%_X5R: Non-polarised capacitor; Part Description: SMD Multilayer Chip Ceramic Capacitor; Manufacturer: GENERIC; Manufacturer1 Part Number: GRM188R61C106MA73D; Voltage: 16V; TC: X5R; Tolerance: ±20%; Part Number: CC0603_10UF_16V_20%_X5R; Component Kind: Standard; Component Type: Standard; Pin Count: 2; Value: 10uF; Status: None; Manufacturer Part Number: CC0603_10UF_16V_20%_X5R; Case: 0603; Mounted: Yes; Socket: No; SMD: Yes; Sense: No; Manufacturer1 Example: MURATA; Manufacturer1 ComponentHeight: 0.8mm; HelpURL: \\cern.ch\dfs\Applications\Altium\Datasheets\CC0603_X5R_MURATA_GRM.pdf; Author: CERN DEM MR; CreateDate: 02.03.2016; LatestRevisionDate: 02.03.2016
C227 = CC0402_2.2NF_50V_10%_X7R: Non-polarised capacitor; Part Description: SMD Multilayer Chip Ceramic Capacitor; Manufacturer: GENERIC; Manufacturer1 Part Number: 223858715627; Voltage: 50V; TC: X7R; Tolerance: ±10%; Part Number: CC0402_2.2NF_50V_10%_X7R; Component Kind: Standard; Component Type: Standard; Pin Count: 2; Value: 2.2nF; Status: Not Recommended; Manufacturer Part Number: CC0402_2.2NF_50V_10%_X7R; Case: 0402; Mounted: Yes; Socket: No; SMD: Yes; Sense: No; Manufacturer1 Example: PHYCOMP; Manufacturer1 ComponentHeight: 0.55mm; HelpURL: \\cern.ch\dfs\Applications\Altium\Datasheets\CC0402_X7R_PHYCOMP.pdf; Author: CERN DEM JLC; CreateDate: 03.12.2007; LatestRevisionDate: 03.12.2007
C228 = CC0402_15NF_16V_10%_X7R: Non-polarised capacitor; Part Description: SMD Multilayer Chip Ceramic Capacitor; Manufacturer: GENERIC; Manufacturer1 Part Number: 223878715638; Voltage: 16V; TC: X7R; Tolerance: ±10%; Part Number: CC0402_15NF_16V_10%_X7R; Component Kind: Standard; Component Type: Standard; Pin Count: 2; Value: 15nF; Status: Not Recommended; Manufacturer Part Number: CC0402_15NF_16V_10%_X7R; Case: 0402; Mounted: Yes; Socket: No; SMD: Yes; Sense: No; Manufacturer1 Example: PHYCOMP; Manufacturer1 ComponentHeight: 0.55mm; HelpURL: \\cern.ch\dfs\Applications\Altium\Datasheets\CC0402_X7R_PHYCOMP.pdf; Author: CERN DEM JLC; CreateDate: 03.12.2007; LatestRevisionDate: 03.12.2007
C233 = CC0201_470NF_4V_20%_X5R: Non-polarised capacitor; Part Description: SMD Multilayer Chip Ceramic Capacitor; Manufacturer: GENERIC; Manufacturer1 Part Number: AMK063BJ474MP-F; Voltage: 4V; TC: X5R; Tolerance: ±20%; Part Number: CC0201_470NF_4V_20%_X5R; Component Kind: Standard; Component Type: Standard; Pin Count: 2; Value: 470nF; Status: Not Recommended; Manufacturer Part Number: CC0201_470NF_4V_20%_X5R; Case: 0201; Mounted: Yes; Socket: No; SMD: Yes; Sense: No; Manufacturer1 Example: TAIYO YUDEN; Manufacturer1 ComponentHeight: 0.33mm; HelpURL: \\cern.ch\dfs\Applications\Altium\Datasheets\CC0201_X5R_TAIYO-YUDEN_STANDARD-CLASS2.pdf; Author: CERN DEM JLC; CreateDate: 27.05.2010; LatestRevisionDate: 27.05.2010
C239 = CC0603_2.2UF_10V_20%_X7R: Non-polarised capacitor; Part Description: SMD Multilayer Chip Ceramic Capacitor; Manufacturer: GENERIC; Manufacturer1 Part Number: LMK107B7225MA-T; Voltage: 10V; TC: X7R; Tolerance: ±20%; Part Number: CC0603_2.2UF_10V_20%_X7R; Component Kind: Standard; Component Type: Standard; Pin Count: 2; Value: 2.2uF; Status: Not Recommended; Manufacturer Part Number: CC0603_2.2UF_10V_20%_X7R; Case: 0603; Mounted: Yes; Socket: No; SMD: Yes; Sense: No; Manufacturer1 Example: TAIYO YUDEN; Manufacturer1 ComponentHeight: 0.9mm; HelpURL: \\cern.ch\dfs\Applications\Altium\Datasheets\CC0603_X7R_TAIYO-YUDEN_HIGH-VALUE.pdf; Author: CERN DEM JLC; CreateDate: 22.06.2011; LatestRevisionDate: 27.06.2011
C240 = CTE3216-18_10UF_10V_10%_LESR1800: Polarised capacitor; Part Description: Low ESR 1R8 Solid Tantalum Chip Capacitor; Manufacturer: GENERIC; Manufacturer1 Part Number: TPSA106K010R1800; Voltage: 10V; Tolerance: ±10%; Part Number: CTE3216-18_10UF_10V_10%_LESR1800; Component Kind: Standard; Component Type: Standard; Pin Count: 2; Value: 10uF; Status: Preferred; Manufacturer Part Number: CTE3216-18_10UF_10V_10%_LESR1800; Case: A; Mounted: Yes; Socket: No; SMD: Yes; Sense: No; Manufacturer1 Example: AVX; Manufacturer1 ComponentHeight: 1.8mm; HelpURL: \\cern.ch\dfs\Applications\Altium\Datasheets\CTE-LESR_AVX_TPS.pdf; Author: CERN DEM JLC; CreateDate: 05.05.2008; LatestRevisionDate: 20.01.2009
D4 = BAV99: Serial Diode; Part Description: Dual Series Signal Diode; Manufacturer: FAIRCHILD SEMICONDUCTOR; Voltage: 70V; Power: 350mW; PressFit: No; Bonding: No; Part Number: BAV99; Component Kind: Standard; Component Type: Standard; Device: BAV99; PackageDescription: SOT, 0.95mm Pitch; 3 Pin, 1.40mm W X 3.00mm L X 1.10mm H body, IPC Medium Density; Manufacturer Part Number: BAV99; Pin Count: 3; Case: SOT23-3; Mounted: Yes; Socket: No; SMD: Yes; Sense: No; ComponentHeight: 1.1mm; HelpURL: \\cern.ch\dfs\Applications\Altium\Datasheets\BAV99.pdf; Author: CERN DEM JLC; CreateDate: 06.05.2008; LatestRevisionDate: 27.09.2012
D5 = CMP-004-00039-1: D1213A-02SR Series 400 mW Uni-Directional Surface Mount TVS Diode - SOT-143; Mounting Technology: Surface Mount; Case/Package: SOT-143; Max Operating Temperature: 150°C; Pins: 4; Min Operating Temperature: -65°C
FB7-FB17 FB32-FB34 = IND0603_MURATA_BLM18SG221TN1: Part Description: SMD EMIFIL Suppression Chip Ferrite Bead; Manufacturer: MURATA; Tolerance: ±25%; Power: 2.5A; Resistance: 0.04R; Part Number: IND0603_MURATA_BLM18SG221TN1; Component Kind: Standard; Component Type: Standard; Pin Count: 2; Value: 220R@100MHz; Manufacturer Part Number: BLM18SG221TN1; Case: 0603; Mounted: Yes; Socket: No; SMD: Yes; Sense: No; ComponentHeight: 0.95mm; HelpURL: \\cern.ch\dfs\Applications\Altium\Datasheets\IND0603_MURATA_BLM18S.pdf; Author: CERN DEM MR; CreateDate: 08.01.2016; LatestRevisionDate: 25.10.2018
IC13 = LTC6957IDD-2#PBF: Low Phase Noise, Dual Output Buffer/Driver/Logic Converter, LVDS Logic Outputs; Manufacturer: LINEAR TECHNOLOGY; PressFit: No; Bonding: No; Part Number: LTC6957IDD-2#PBF; Component Kind: Standard; Component Type: Standard; Device: LTC6957IDD-2; PackageDescription: SON, 0.45mm Pitch; 12 Pin, 3.00mm W X 3.00mm L X 0.80mm H Body (w/Thermal tab 1.75 x 2.48mm), IPC Medium Density; Part Description: Low Phase Noise, Dual Output Buffer/Driver/Logic Converter, LVDS Logic Outputs; Manufacturer Part Number: LTC6957IDD-2; Pin Count: 13; Case: SON12; Mounted: Yes; Socket: No; SMD: Yes; Sense: No; ComponentHeight: 0.8mm; Author: CERN DEM MR; HelpURL: \\cern.ch\dfs\Applications\Altium\Datasheets\LTC6957IDD-2#PBF.pdf; CreateDate: 12.09.2016; LatestRevisionDate: 02.02.2022
IC14 IC15 = CMP-0288-00048-2: 14 Outputs Clock Generator with Integrated 1.6 GHz VCO, 3.3 V Supply, Industrial, 64-pin QFN (CP-64-4), Tray; Manufacturer: Analog Devices; # of Outputs: 14; Supply Voltage (V): 3.3; # of Inputs: 2; On-Chip VCO or DCO: Yes; Max f-out: 1.8 GHz; Output Logic: CMOS, LVDS, LVPECL; I/O Interface: Serial; ComponentLink1URL: http://www.analog.com/en/index.html; ComponentLink3URL: http://www.analog.com/static/imported-files/packages/PKG_PDF/LFCSP(CP)/CP_64_4.pdf; ComponentLink1Description: Manufacturer URL; ComponentLink2Description: Datasheet; PartNumber: AD9516-4BCPZ; ComponentLink4URL: http://www.analog.com/en/clock-and-timing/clock-generation-and-distribution/ad9516-4/products/product.html; PackageReference: CP-64-4; PackageVersion: 06-12-2012-B, 06/2012; Mounting Technology: Surface Mount; Packing: Tray; ComponentLink4Description: Product URL; PackageDescription: 64-Pin Lead Frame Chip Scale Package, Body 9 x 9 mm, Pitch 0.5 mm; Code_JEDEC: MO-220-VMMD-4; DatasheetVersion: Rev. B; ComponentLink5URL: http://www.analog.com/en/clock-and-timing/clock-generation-and-distribution/ad9516-4/products/product.html#product-recommendations; ComponentLink3Description: Package Specification; ComponentLink2URL: http://www.analog.com/static/imported-files/data_sheets/AD9516-4.pdf; ComponentLink5Description: Reference Circuit
IC16 = LMX2572RHA: 15GHz Wideband PLLatinum RF Synthesizer with Phase Synchronization and JESD204B Support; Part Description: Low power wideband RF synthesizer with phase synchronization and JESD204B support; Manufacturer: TEXAS INSTRUMENTS; PressFit: No; Bonding: No; Part Number: LMX2572RHA; Component Kind: Standard; Component Type: Standard; Device: LMX2572RHA; PackageDescription: QFN, 0.50mm Pitch, Square; 40 Pin, 6.00mm L X 6.00mm W X 1.00mm H body (w/Thermal Tab 4.60 x 4.60mm), IPC Medium Density; Manufacturer Part Number: LMX2572RHA; Pin Count: 41; Case: QFN40; Mounted: Yes; Socket: No; SMD: Yes; Sense: No; ComponentHeight: 1mm; Author: CERN DEM HF; HelpURL: \\cern.ch\dfs\Applications\Altium\Datasheets\LMX2572.pdf; CreateDate: 15.04.2024; LatestRevisionDate: 15.04.2024
IC19 = MIC5219-3.3YM5: 500mA Peak Output LDO Regulator; Part Description: 3.3V 500mA Peak Output Low Drop-Out  (LDO) Regulator; Manufacturer: MICROCHIP TECHNOLOGY; PressFit: No; Bonding: No; Part Number: MIC5219-3.3YM5; Component Kind: Standard; Component Type: Standard; Device: MIC5219-3.3YM5; PackageDescription: SOT23, 0.95mm Pitch; 5 Pin, 1.60mm W X 2.90mm L X 1.45mm H body, IPC Medium Density; Manufacturer Part Number: MIC5219-3.3YM5; Pin Count: 5; Case: SOT23-5; Mounted: Yes; Socket: No; SMD: Yes; Sense: No; ComponentHeight: 1.45mm; HelpURL: \\cern.ch\dfs\Applications\Altium\Datasheets\MIC5219-3.3YM5.pdf; Author: CERN DEM WB; CreateDate: 16.04.2019; LatestRevisionDate: 16.04.2019
J7-J9 = CMP-002-04652-1: SMA connector Delock 65848
LD9 = LED_KINGBRIGHT_KPH-1608CGCK: LED Green 1C 2A; Part Description: SMD Green LED, Case 1.6mmX0.8mm(0603), 0.65mm Thickness; PressFit: No; Bonding: No; Manufacturer Part Number: KPH-1608CGCK; ComponentHeight: 0.65mm; HelpURL: \\cern.ch\dfs\Applications\Altium\Datasheets\LED_KINGBRIGHT_KPH-1608CGCK.pdf; Part Number: LED_KINGBRIGHT_KPH-1608CGCK; Component Kind: Standard; Component Type: Standard; Color: Green; PackageDescription: SMT Green LED, Case 0603, Body L 1.6 x W 0.8mm H 0.65mm; Manufacturer: KINGBRIGHT; Pin Count: 2; Mounted: Yes; Socket: No; SMD: Yes; Sense: No; Author: CERN DEM JLC; CreateDate: 03.07.2017; LatestRevisionDate: 03.07.2017
R57 R60 R62 = R0402_100R_1%_0.0625W_100PPM: Resistor - 1%; Part Description: General Purpose Thick Film Chip Resistor; Manufacturer: GENERIC; Manufacturer1 Part Number: 232270671001L; TC: ±100ppm/°C; PressFit: No; Part Number: R0402_100R_1%_0.0625W_100PPM; Component Kind: Standard; Component Type: Standard; Pin Count: 2; Value: 100; Status: Not Recommended; Power: 0.0625W; Manufacturer Part Number: R0402_100R_1%_0.0625W_100PPM; Case: 0402; Mounted: Yes; Sense: No; Socket: No; SMD: Yes; Manufacturer1 Example: YAGEO PHYCOMP; Manufacturer1 ComponentHeight: 0.4mm; HelpURL: \\cern.ch\dfs\Applications\Altium\Datasheets\R0402_Phycomp_RC0402.pdf; Author: CERN DEM JLC; CreateDate: 03.12.2007; LatestRevisionDate: 17.10.2012
R58 R63-R65 R79 R156-R158 = R0402_0R_JUMPER: as R1 on sheet SPEC-A7-TOP; Part Number: R0402_0R_JUMPER; Component Kind: Standard; Component Type: Standard; Pin Count: 2; Value: 0; Status: Not Recommended; Manufacturer Part Number: R0402_0R_JUMPER; Case: 0402; Mounted: Yes; Sense: No; Socket: No; SMD: Yes; Manufacturer1 Example: YAGEO PHYCOMP; Manufacturer1 ComponentHeight: 0.4mm; HelpURL: \\cern.ch\dfs\Applications\Altium\Datasheets\R0402_Phycomp_RC0402.pdf; Author: CERN DEM JLC; CreateDate: 03.12.2007; LatestRevisionDate: 17.10.2012
R59 R61 = R0402_300R_1%_0.0625W_100PPM: Resistor - 1%; Part Description: General Purpose Thick Film Chip Resistor; Manufacturer: GENERIC; Manufacturer1 Part Number: 232270673001L; TC: ±100ppm/°C; PressFit: No; Part Number: R0402_300R_1%_0.0625W_100PPM; Component Kind: Standard; Component Type: Standard; Pin Count: 2; Value: 300; Status: Not Recommended; Power: 0.0625W; Manufacturer Part Number: R0402_300R_1%_0.0625W_100PPM; Case: 0402; Mounted: Yes; Sense: No; Socket: No; SMD: Yes; Manufacturer1 Example: YAGEO PHYCOMP; Manufacturer1 ComponentHeight: 0.4mm; HelpURL: \\cern.ch\dfs\Applications\Altium\Datasheets\R0402_Phycomp_RC0402.pdf; Author: CERN DEM JLC; CreateDate: 03.12.2007; LatestRevisionDate: 17.10.2012
R66 R67 R70 = R0402_5K1_1%_0.0625W_100PPM: Resistor - 1%; Part Description: General Purpose Thick Film Chip Resistor; Manufacturer: GENERIC; Manufacturer1 Part Number: 232270675102L; TC: ±100ppm/°C; PressFit: No; Part Number: R0402_5K1_1%_0.0625W_100PPM; Component Kind: Standard; Component Type: Standard; Pin Count: 2; Value: 5k1; Status: Not Recommended; Power: 0.0625W; Manufacturer Part Number: R0402_5K1_1%_0.0625W_100PPM; Case: 0402; Mounted: Yes; Sense: No; Socket: No; SMD: Yes; Manufacturer1 Example: YAGEO PHYCOMP; Manufacturer1 ComponentHeight: 0.4mm; HelpURL: \\cern.ch\dfs\Applications\Altium\Datasheets\R0402_Phycomp_RC0402.pdf; Author: CERN DEM JLC; CreateDate: 03.12.2007; LatestRevisionDate: 17.10.2012
R68 R69 R71 = R0402_4K12_1%_0.0625W_100PPM: Resistor - 1%; Part Description: General Purpose Thick Film Chip Resistor; Manufacturer: GENERIC; Manufacturer1 Part Number: 232270674122L or RC0402FR-074K12L; TC: ±100ppm/°C; PressFit: No; Part Number: R0402_4K12_1%_0.0625W_100PPM; Component Kind: Standard; Component Type: Standard; Pin Count: 2; Value: 4k12; Status: Not Recommended; Power: 0.0625W; Manufacturer Part Number: R0402_4K12_1%_0.0625W_100PPM; Case: 0402; Mounted: Yes; Sense: No; Socket: No; SMD: Yes; Manufacturer1 Example: YAGEO PHYCOMP; Manufacturer1 ComponentHeight: 0.4mm; HelpURL: \\cern.ch\dfs\Applications\Altium\Datasheets\R0402_Phycomp_RC0402.pdf; Author: CERN DEM JLC; CreateDate: 24.10.2012; LatestRevisionDate: 24.10.2012
R72 = R0402_750R_1%_0.0625W_100PPM: Resistor - 1%; Part Description: General Purpose Thick Film Chip Resistor; Manufacturer: GENERIC; Manufacturer1 Part Number: 232270677501L; TC: ±100ppm/°C; PressFit: No; Part Number: R0402_750R_1%_0.0625W_100PPM; Component Kind: Standard; Component Type: Standard; Pin Count: 2; Value: 750; Status: Not Recommended; Power: 0.0625W; Manufacturer Part Number: R0402_750R_1%_0.0625W_100PPM; Case: 0402; Mounted: Yes; Sense: No; Socket: No; SMD: Yes; Manufacturer1 Example: YAGEO PHYCOMP; Manufacturer1 ComponentHeight: 0.4mm; HelpURL: \\cern.ch\dfs\Applications\Altium\Datasheets\R0402_Phycomp_RC0402.pdf; Author: CERN DEM JLC; CreateDate: 03.12.2007; LatestRevisionDate: 17.10.2012
R73 = R0402_820R_1%_0.0625W_100PPM: Resistor - 1%; Part Description: General Purpose Thick Film Chip Resistor; Manufacturer: GENERIC; Manufacturer1 Part Number: 232270678201L; TC: ±100ppm/°C; PressFit: No; Part Number: R0402_820R_1%_0.0625W_100PPM; Component Kind: Standard; Component Type: Standard; Pin Count: 2; Value: 820; Status: Not Recommended; Power: 0.0625W; Manufacturer Part Number: R0402_820R_1%_0.0625W_100PPM; Case: 0402; Mounted: Yes; Sense: No; Socket: No; SMD: Yes; Manufacturer1 Example: YAGEO PHYCOMP; Manufacturer1 ComponentHeight: 0.4mm; HelpURL: \\cern.ch\dfs\Applications\Altium\Datasheets\R0402_Phycomp_RC0402.pdf; Author: CERN DEM JLC; CreateDate: 03.12.2007; LatestRevisionDate: 17.10.2012
R74 = R0402_390R_1%_0.0625W_100PPM: Resistor - 1%; Part Description: General Purpose Thick Film Chip Resistor; Manufacturer: GENERIC; Manufacturer1 Part Number: 232270673901L; TC: ±100ppm/°C; PressFit: No; Part Number: R0402_390R_1%_0.0625W_100PPM; Component Kind: Standard; Component Type: Standard; Pin Count: 2; Value: 390; Status: Not Recommended; Power: 0.0625W; Manufacturer Part Number: R0402_390R_1%_0.0625W_100PPM; Case: 0402; Mounted: Yes; Sense: No; Socket: No; SMD: Yes; Manufacturer1 Example: YAGEO PHYCOMP; Manufacturer1 ComponentHeight: 0.4mm; HelpURL: \\cern.ch\dfs\Applications\Altium\Datasheets\R0402_Phycomp_RC0402.pdf; Author: CERN DEM JLC; CreateDate: 03.12.2007; LatestRevisionDate: 17.10.2012
R75 = R0603_2K7_1%_0.1W_100PPM: Resistor - 1%; Part Description: General Purpose Thick Film Chip Resistor; Manufacturer: GENERIC; Manufacturer1 Part Number: RC0603FR-072K7L; Power: 0.1W; TC: ±100ppm/°C; PressFit: No; Part Number: R0603_2K7_1%_0.1W_100PPM; Component Kind: Standard; Component Type: Standard; Pin Count: 2; Value: 2k7; Status: Preferred; Manufacturer Part Number: R0603_2K7_1%_0.1W_100PPM; Case: 0603; Mounted: Yes; Sense: No; Socket: No; SMD: Yes; Manufacturer1 Example: YAGEO PHYCOMP; Manufacturer1 ComponentHeight: 0.55mm; HelpURL: \\cern.ch\dfs\Applications\Altium\Datasheets\R0603_PHYCOMP_RC0603.pdf; Author: CERN DEM JLC; CreateDate: 02.05.2011; LatestRevisionDate: 02.05.2011
R76 R77 = R0402_49R9_1%_0.0625W_100PPM: Resistor - 1%; Part Description: General Purpose Thick Film Chip Resistor; Manufacturer: GENERIC; Manufacturer1 Part Number: 232270674999L or RC0402FR-0749R9L; TC: ±100ppm/°C; PressFit: No; Part Number: R0402_49R9_1%_0.0625W_100PPM; Component Kind: Standard; Component Type: Standard; Pin Count: 2; Value: 49R9; Status: Not Recommended; Power: 0.0625W; Manufacturer Part Number: R0402_49R9_1%_0.0625W_100PPM; Case: 0402; Mounted: Yes; Sense: No; Socket: No; SMD: Yes; Manufacturer1 Example: YAGEO PHYCOMP; Manufacturer1 ComponentHeight: 0.4mm; HelpURL: \\cern.ch\dfs\Applications\Altium\Datasheets\R0402_Phycomp_RC0402.pdf; Author: CERN DEM JLC; CreateDate: 24.10.2012; LatestRevisionDate: 24.10.2012
R81 R82 = R0402_330R_1%_0.0625W_100PPM: Resistor - 1%; Part Description: General Purpose Thick Film Chip Resistor; Manufacturer: GENERIC; Manufacturer1 Part Number: 232270673301L; TC: ±100ppm/°C; PressFit: No; Part Number: R0402_330R_1%_0.0625W_100PPM; Component Kind: Standard; Component Type: Standard; Pin Count: 2; Value: 330; Status: Not Recommended; Power: 0.0625W; Manufacturer Part Number: R0402_330R_1%_0.0625W_100PPM; Case: 0402; Mounted: Yes; Sense: No; Socket: No; SMD: Yes; Manufacturer1 Example: YAGEO PHYCOMP; Manufacturer1 ComponentHeight: 0.4mm; HelpURL: \\cern.ch\dfs\Applications\Altium\Datasheets\R0402_Phycomp_RC0402.pdf; Author: CERN DEM JLC; CreateDate: 03.12.2007; LatestRevisionDate: 17.10.2012
TP12 = SMD_PAD_1.27X1.27MM: Part Description: 1.27mm x 1.27mm PCB Copper Area (SMD Test Point); Mounted: No; Part Number: SMD_PAD_1.27X1.27MM; Component Type: Standard (No BOM); Pin Count: 1; Family: Test Point; Socket: No; SMD: Yes; Sense: No; Status: None; ComponentHeight: 0mm; HelpURL: Undefined; Author: CERN DEM JLC; CreateDate: 12.01.2008; LatestRevisionDate: 12.01.2008; PackageDescription: 1.27mm x 1.27mm PCB Copper Area (SMD Test Point)
TR1 = XFMR_COILCRAFT_WBC16-1TLB: SMT Transformer WBC Series Type B Pinout; Part Description: Surface Mount Mini Wideband Transformer, WBC Series (Violet Dot); Part Number: XFMR_COILCRAFT_WBC16-1TLB; Component Kind: Standard; Component Type: Standard; Pin Count: 6; Value: 1:16; Status: None; Manufacturer: COILCRAFT; Manufacturer Part Number: WBC16-1TL; Mounted: Yes; Socket: No; Sense: No; SMD: Yes; ComponentHeight: 3.05mm; HelpURL: \\cern.ch\dfs\Applications\Altium\Datasheets\XFMR_COILCRAFT_WBC.pdf; Author: CERN DEM JLC; CreateDate: 27.09.2016; LatestRevisionDate: 27.09.2016